# EAGLE design arcade_controller (EAGLE 6.3)

## Sheet 1 of 2: LM3S5749
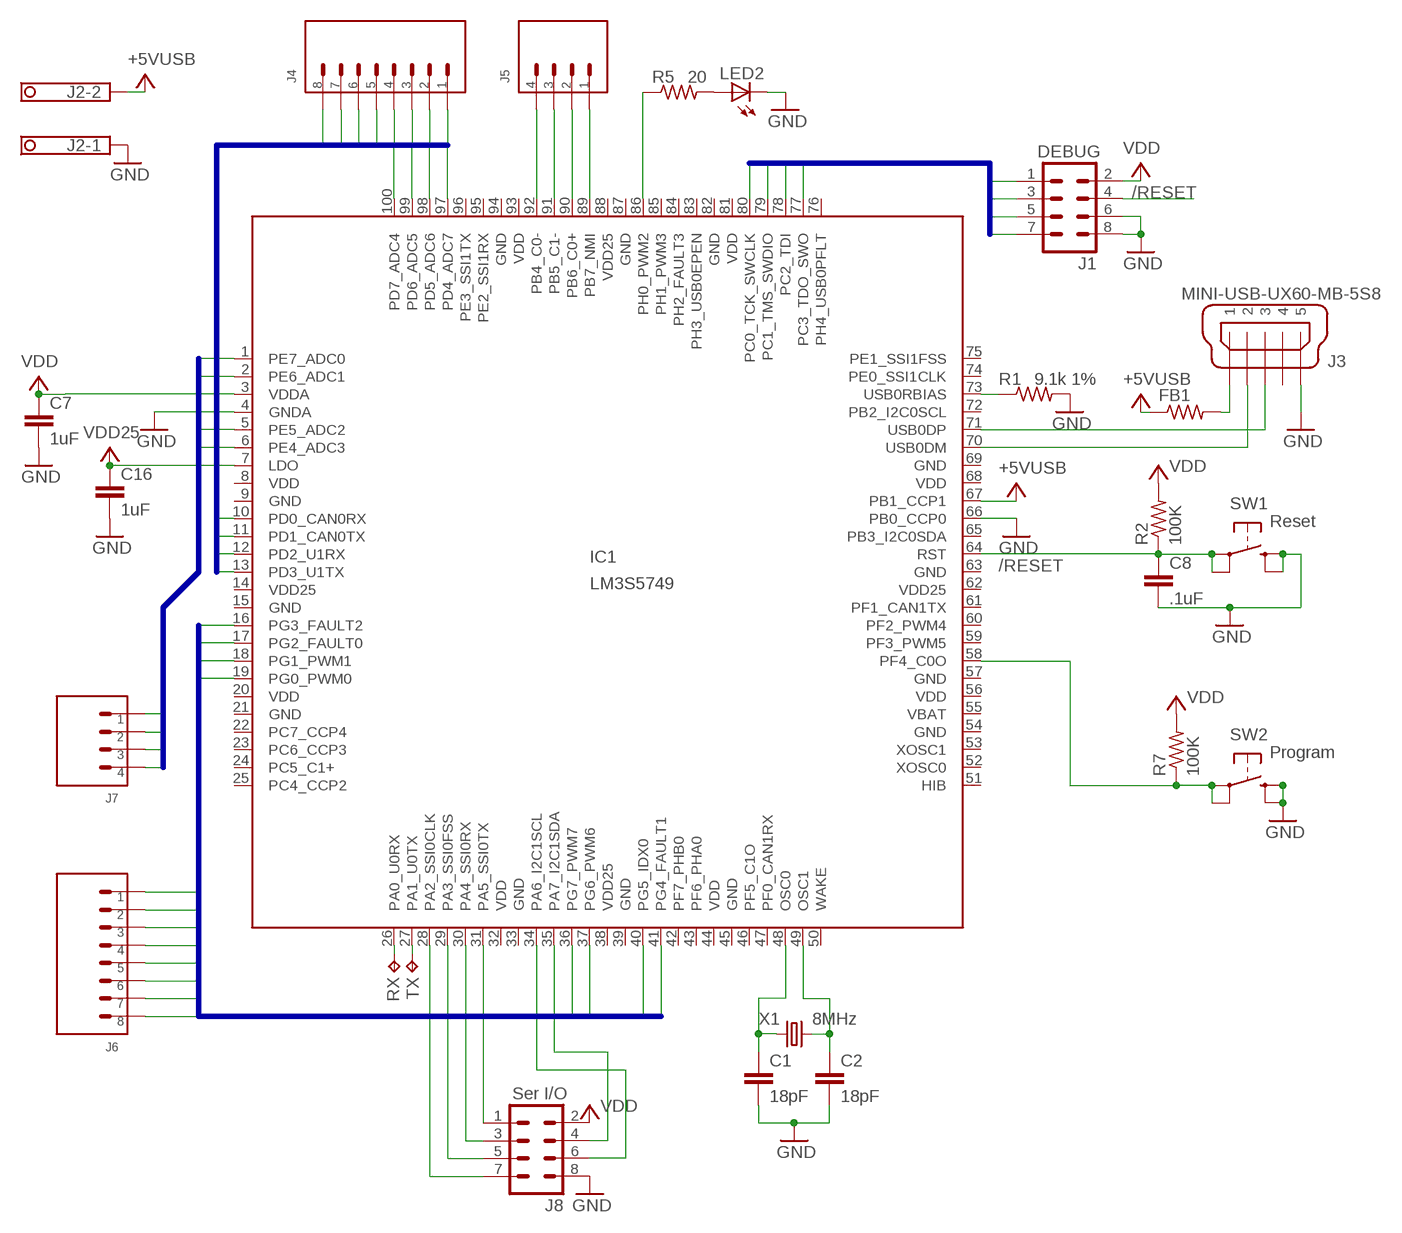
[diagram p0: schematic, sheet 1]

### Parts
C1  18pF  C-EUC0603  [C0603]
C2  18pF  C-EUC0603  [C0603]
C7  1uF  C-EUC0603  [C0603]
C8  .1uF  C-EUC0603  [C0603]
C16  1uF  C-EUC0603  [C0603]
FB1  0  R-US_R0805  [R0805]
IC1  LM3S5749  [LQFP-100]
J1  DEBUG  HEADER_4X2  [HEADER_.100IN_8PIN_4X2]
J2  1751248  [1751248]
J3  MINI-USB-UX60-MB-5S8  [UX60-MB-5S8]
J4  PTSM_1771088  [PTSM_1771088]
J5  PTSM_1702474  [PTSM_1702474]
J6  PTSM_1771088  [PTSM_1771088]
J7  PTSM_1702474  [PTSM_1702474]
J8  Ser I/O  HEADER_4X2  [HEADER_.100IN_8PIN_4X2]
LED2  LEDCHIPLED_0603  [CHIPLED_0603]
R1  9.1k 1%  R-US_R0603  [R0603]
R2  100K  R-US_R0603  [R0603]
R5  20  R-US_R0603  [R0603]
R7  100K  R-US_R0603  [R0603]
RX  TPTP10R  [TP10R]
SW1  Reset  SMT_PUSHBUTTON  [SMT_PUSHBUTTON]
SW2  Program  SMT_PUSHBUTTON  [SMT_PUSHBUTTON]
TX  TPTP10R  [TP10R]
X1  8MHz  XTAL_2SMD_8MMX4.5MM  [2-SMD_8MMX4.5MM]

### Nets
/PROG: IC1.58(PF4_C0O) R7.1 SW2.P$1(P1) SW2.P$2(P)
/RESET: C8.1 IC1.64(RST) J1.4 R2.1 SW1.P$1(P1) SW1.P$2(P)
GND [Filled Plane]: C1.2 C2.2 C7.2 C8.2 C16.2 IC1.4(GNDA) IC1.66(PB0_CCP0) J1.6 J1.8 J2.1 J3.5 J8.8 LED2.C R1.2 SW1.P$3(S1) SW1.P$4(S) SW2.P$3(S1) SW2.P$4(S) ; also sheet 2
N$1: IC1.73(USB0RBIAS) R1.1
N$2: C1.1 IC1.48(OSC0) X1.1
N$3: C2.1 IC1.49(OSC1) X1.2
N$5: IC1.26(PA0_U0RX) RX.TP
N$6: IC1.27(PA1_U0TX) TX.TP
N$7: FB1.2 J3.1
N$8: FB1.1 IC1.67(PB1_CCP1) J2.2 ; supply symbol labelled +5VUSB ; also sheet 2
N$9: IC1.89(PB7_NMI) J5.P$1(S1)
N$10: IC1.90(PB6_C0+) J5.P$2(S2)
N$11: IC1.91(PB5_C1-) J5.P$3(S3)
N$12: IC1.92(PB4_C0-) J5.P$4(S4)
N$13: IC1.86(PH0_PWM2) R5.1
N$14: IC1.31(PA5_SSI0TX) J8.1
N$15: LED2.A R5.2
N$16: IC1.30(PA4_SSI0RX) J8.3
N$17: IC1.71(USB0DP) J3.3
N$18: IC1.70(USB0DM) J3.2
N$19: IC1.29(PA3_SSI0FSS) J8.5
N$20: IC1.28(PA2_SSI0CLK) J8.7
N$21: IC1.35(PA7_I2C1SDA) J8.4
N$22: IC1.34(PA6_I2C1SCL) J8.6
PD0: IC1.10(PD0_CAN0RX) J4.P$1(S1)
PD1: IC1.11(PD1_CAN0TX) J4.P$2(S2)
PD2: IC1.12(PD2_U1RX) J4.P$3(S3)
PD3: IC1.13(PD3_U1TX) J4.P$4(S4)
PD4: IC1.97(PD4_ADC7) J4.P$5(S5)
PD5: IC1.98(PD5_ADC6) J4.P$6(S6)
PD6: IC1.99(PD6_ADC5) J4.P$7(S7)
PD7: IC1.100(PD7_ADC4) J4.P$8(S8)
PE4: IC1.6(PE4_ADC3) J7.P$4(S4)
PE5: IC1.5(PE5_ADC2) J7.P$3(S3)
PE6: IC1.2(PE6_ADC1) J7.P$2(S2)
PE7: IC1.1(PE7_ADC0) J7.P$1(S1)
PG0: IC1.19(PG0_PWM0) J6.P$8(S8)
PG1: IC1.18(PG1_PWM1) J6.P$7(S7)
PG2: IC1.17(PG2_FAULT0) J6.P$6(S6)
PG3: IC1.16(PG3_FAULT2) J6.P$5(S5)
PG4: IC1.41(PG4_FAULT1) J6.P$4(S4)
PG5: IC1.40(PG5_IDX0) J6.P$3(S3)
PG6: IC1.37(PG6_PWM6) J6.P$2(S2)
PG7: IC1.36(PG7_PWM7) J6.P$1(S1)
TCK: IC1.80(PC0_TCK_SWCLK) J1.1
TDI: IC1.78(PC2_TDI) J1.5
TDO: IC1.77(PC3_TDO_SWO) J1.7
TMS: IC1.79(PC1_TMS_SWDIO) J1.3
VDD: C7.1 IC1.3(VDDA) J1.2 J8.2 R2.2 R7.2 ; also sheet 2
VDD25: C16.1 IC1.7(LDO) ; also sheet 2
Unconnected: IC1.22(PC7_CCP4) IC1.23(PC6_CCP3) IC1.24(PC5_C1+) IC1.25(PC4_CCP2) IC1.42(PF7_PHB0) IC1.43(PF6_PHA0) IC1.46(PF5_C1O) IC1.47(PF0_CAN1RX) IC1.50(WAKE) IC1.51(HIB) IC1.52(XOSC0) IC1.53(XOSC1) IC1.55(VBAT) IC1.59(PF3_PWM5) IC1.60(PF2_PWM4) IC1.61(PF1_CAN1TX) IC1.65(PB3_I2C0SDA) IC1.72(PB2_I2C0SCL) IC1.74(PE0_SSI1CLK) IC1.75(PE1_SSI1FSS) IC1.76(PH4_USB0PFLT) IC1.83(PH3_USB0EPEN) IC1.84(PH2_FAULT3) IC1.85(PH1_PWM3) IC1.95(PE2_SSI1RX) IC1.96(PE3_SSI1TX) J3.4

### Buses
TCK,TMS,TDI,TDO
PG[0..7]
PD[0..7]
PE[4..7]

## Sheet 2 of 2: Power
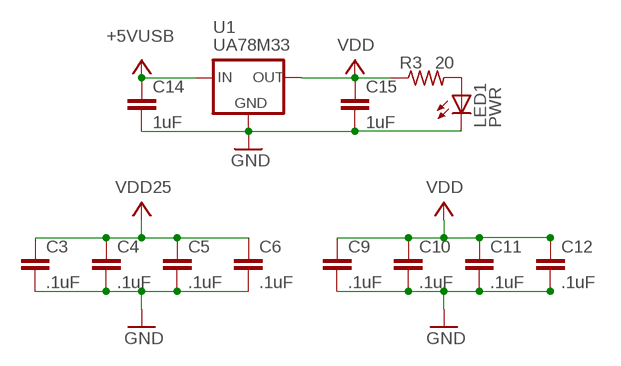
[diagram p1: schematic, sheet 2]

### Parts
C3  .1uF  C-EUC0603  [C0603]
C4  .1uF  C-EUC0603  [C0603]
C5  .1uF  C-EUC0603  [C0603]
C6  .1uF  C-EUC0603  [C0603]
C9  .1uF  C-EUC0603  [C0603]
C10  .1uF  C-EUC0603  [C0603]
C11  .1uF  C-EUC0603  [C0603]
C12  .1uF  C-EUC0603  [C0603]
C14  1uF  C-EUC0603  [C0603]
C15  1uF  C-EUC0603  [C0603]
LED1  PWR  LEDCHIPLED_0603  [CHIPLED_0603]
R3  20  R-US_R0603  [R0603]
U1  UA78M33  [SOT-223]

### Nets
GND [Filled Plane]: C3.2 C4.2 C5.2 C6.2 C9.2 C10.2 C11.2 C12.2 C14.2 C15.2 LED1.C U1.2(GND) U1.4(GND) ; also sheet 1
N$4: LED1.A R3.2
N$8: C14.1 U1.1(IN) ; supply symbol labelled +5VUSB ; also sheet 1
VDD: C9.1 C10.1 C11.1 C12.1 C15.1 R3.1 U1.3(OUT) ; also sheet 1
VDD25: C3.1 C4.1 C5.1 C6.1 ; also sheet 1

## Power pins joined to a net without a drawn wire
GND: IC1.9(GND) IC1.15(GND) IC1.21(GND) IC1.33(GND) IC1.39(GND) IC1.45(GND) IC1.54(GND) IC1.57(GND) IC1.63(GND) IC1.69(GND) IC1.82(GND) IC1.87(GND) IC1.94(GND)
VDD: IC1.8(VDD) IC1.20(VDD) IC1.32(VDD) IC1.44(VDD) IC1.56(VDD) IC1.68(VDD) IC1.81(VDD) IC1.93(VDD)
VDD25: IC1.14(VDD25) IC1.38(VDD25) IC1.62(VDD25) IC1.88(VDD25)

## Library data of the parts
C1-C12 C14-C16 = rcl:C-EU: CAPACITOR, European symbol
FB1 R1-R3 R5 R7 = rcl:R-US_: RESISTOR, American symbol
IC1 = Custom:LM3S5749: SPMM147_lm3s5749_ra0_lqfp_v1p0 edit this description Auto generated by make-symbol-device-package-bsdl_edited.ulp Rev. 42 Source: SPMM147_lm3s5749_ra0_lqfp_v1p0.bsdl
J1 J8 = Custom:HEADER_4X2
J2 = con-phoenix-350:1751248: MKDS 1/ 2-3,5 Printklemme Nennstrom: 10 A Bemessungsspannung: 160 V Raster: 3,5 mm Polzahl: 2 Montageart: Löten Anschlussart: Schraubanschluss Anschlussrichtung vom Leiter zur Platine: 0° Source: http://eshop.phoenixcontact.com .. 1751248.pdf; OC_FARNELL: unknown; OC_NEWARK: unknown
J3 = con-hirose:MINI-USB-: MINI USB Connector Source: http://www.hirose.co.jp/cataloge_hp/e24000019.pdf; OC_FARNELL: unknown; OC_NEWARK: unknown
J4 J6 = Custom:PTSM_1771088
J5 J7 = Custom:PTSM_1702474
LED1 LED2 = led:LED: LED OSRAM: - CHIPLED LG R971, LG N971, LY N971, LG Q971, LY Q971, LO R971, LY R971 LH N974, LH R974 LS Q976, LO Q976, LY Q976 LO Q996 - Hyper CHIPLED LW Q18S LB Q993, LB Q99A, LB R99A - SideLED LS A670, LO A670, LY A670, LG A670, LP A670 LB A673, LV A673, LT A673, LW A673 LH A674 LY A675 LS A676, LA A676, LO A676, LY A676, LW A676 LS A679, LY A679, LG A679 - Hyper Micro SIDELED® LS Y876, LA Y876, LO Y876, LY Y876 LT Y87S - SmartLED LW L88C, LW L88S LB L89C, LB L89S, LG L890 LS L89K, LO L89K, LY L89K LS L896, LA L896, LO L896, LY L896 - TOPLED LS T670, LO T670, LY T670, LG T670, LP T670 LSG T670, LSP T670, LSY T670, LOP T670, LYG T670 LG T671, LOG T671, LSG T671 LB T673, LV T673, LT T673, LW T673 LH T674 LS T676, LA T676, LO T676, LY T676, LB T676, LH T676, LSB T676, LW T676 LB T67C, LV T67C, LT T67C, LS T67K, LO T67K, LY T67K, LW E67C LS E67B, LA E67B, LO E67B, LY E67B, LB E67C, LV E67C, LT E67C LW T67C LS T679, LY T679, LG T679 LS T770, LO T770, LY T770, LG T770, LP T770 LB T773, LV T773, LT T773, LW T773 LH T774 LS E675, LA E675, LY E675, LS T675 LS T776, LA T776, LO T776, LY T776, LB T776 LHGB T686 LT T68C, LB T68C - Hyper Mini TOPLED® LB M676 - Mini TOPLED Santana® LG M470 LS M47K, LO M47K, LY M47K Source: http://www.osram.convergy.de LUXEON: - LUMILED® LXK2-PW12-R00, LXK2-PW12-S00, LXK2-PW14-U00, LXK2-PW14-V00 LXK2-PM12-R00, LXK2-PM12-S00, LXK2-PM14-U00 LXK2-PE12-Q00, LXK2-PE12-R00, LXK2-PE12-S00, LXK2-PE14-T00, LXK2-PE14-U00 LXK2-PB12-K00, LXK2-PB12-L00, LXK2-PB12-M00, LXK2-PB14-N00, LXK2-PB14-P00, LXK2-PB14-Q00 LXK2-PR12-L00, LXK2-PR12-M00, LXK2-PR14-Q00, LXK2-PR14-R00 LXK2-PD12-Q00, LXK2-PD12-R00, LXK2-PD12-S00 LXK2-PH12-R00, LXK2-PH12-S00 LXK2-PL12-P00, LXK2-PL12-Q00, LXK2-PL12-R00 Source: www.luxeon.com KINGBRIGHT: KA-3528ASYC Source: www.kingbright.com
RX TX = testpad:TP: Test pad
SW1 SW2 = Custom:SMT_PUSHBUTTON: SMT Pushbutton 5.2 x 5.2 mm
U1 = Custom:UA78M33: uA78M33 - Positive Voltage Regulator 3.3V 500mA Fixed Positive-Voltage Regulator Datasheet: http://www.ti.com/lit/ds/symlink/ua78m33.pdf; DIGIKEY: 296-13424-1-ND
X1 = Custom:XTAL_2SMD_8MMX4.5MM: SMD Crystal 2-SMD 8.0 x 4.5 x 1.4mm Crystal Taken from: http://www.abracon.com/Resonators/abm2.pdf; DIGIKEY: 535-10870-1-ND

## Board
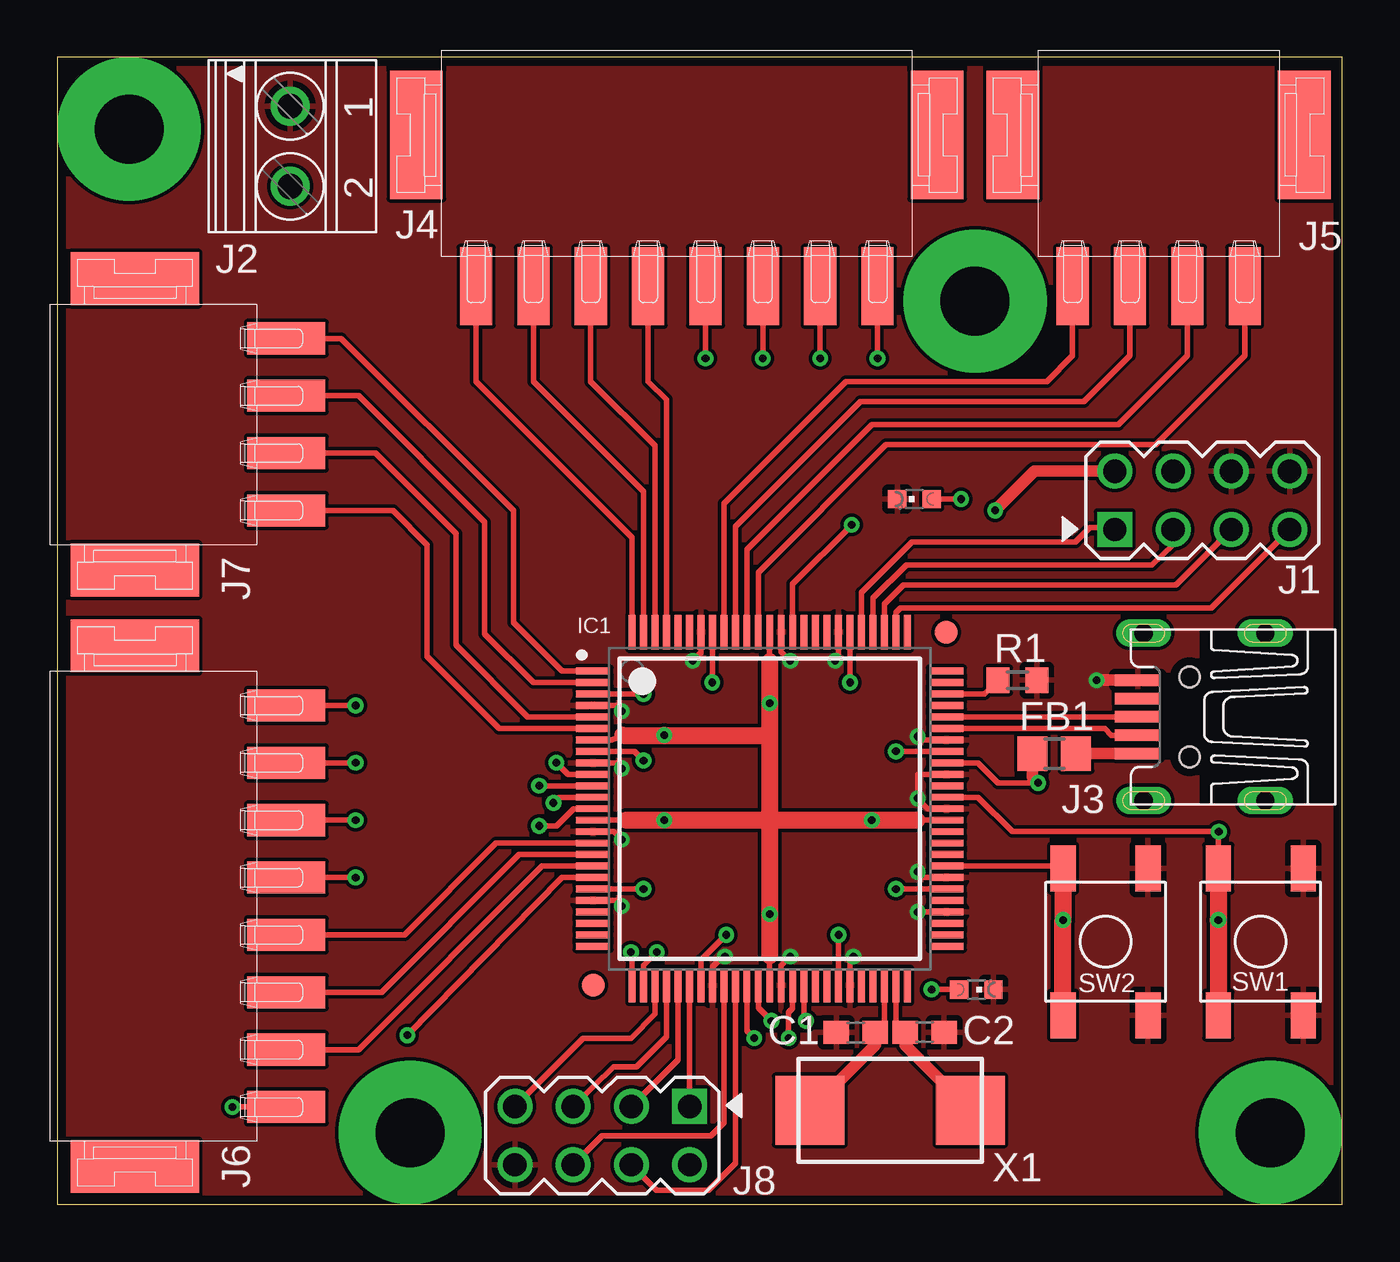
[diagram p2: board, top side]
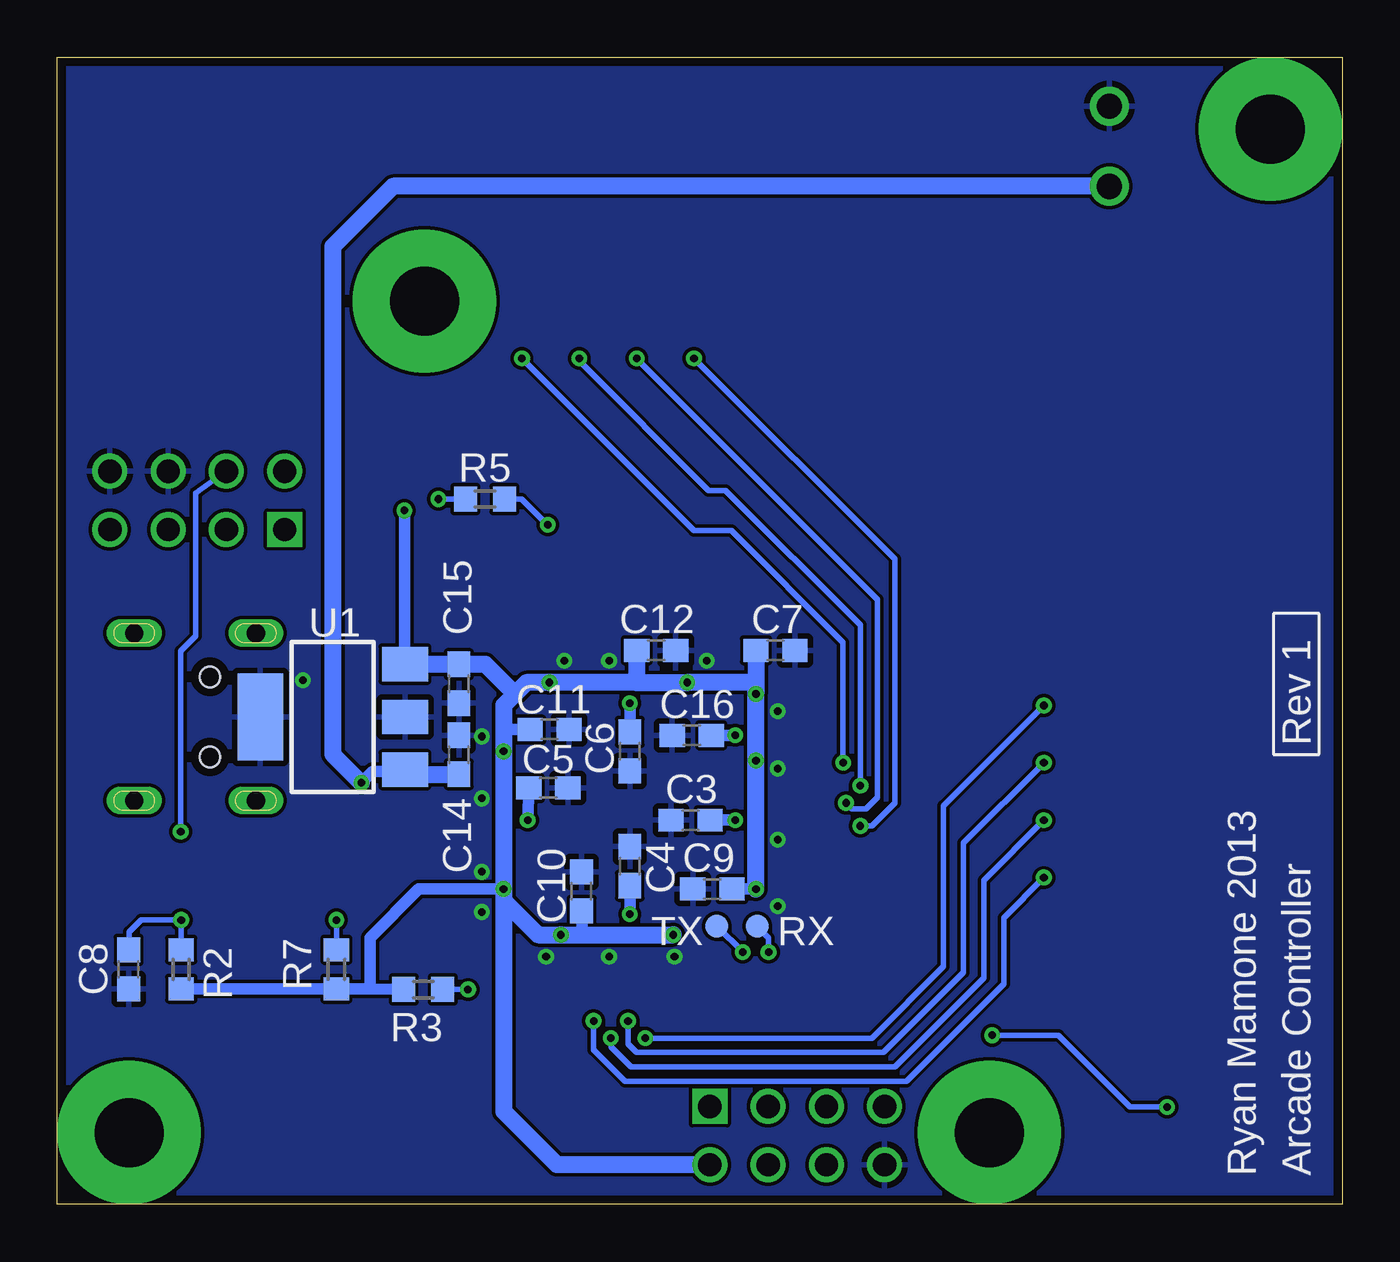
[diagram p3: board, bottom side, seen from below]

Size 56 x 50 mm. Coordinates in mm from the lower left corner, seen from the top.
Outline: 0,0 56,0 56,50 0,50 0,0
Copper layers (1*16): Top 0.0356mm / dielectric 1.5011mm / Bottom 0.0356mm
Design rules "LaenPCBOrder": minimum track width 6mil, minimum drill 13mil, track to track 6mil, track to pad 6mil, pad to pad 6mil, via to via 6mil, smd to smd 6mil, copper to edge 15mil, drill to drill 6mil, minimum pad ring 7mil, minimum via ring 7mil, stop-mask expansion 4mil, vias tented up to drill 0mil, thermal gap 10mil

### Footprints (pad centres in the part's own frame; a part is rotated, then mirrored left to right if it is on the bottom)
C0603 = smd 1.1 x 1: 1 -0.85,0; 2 0.85,0
R0805 = smd 1.3 x 1.5: 1 -0.95,0; 2 0.95,0
LQFP-100 = smd 1.5 x 0.3: 1 -7.7,6; 2 -7.7,5.5; 3 -7.7,5; 4 -7.7,4.5; 5 -7.7,4; 6 -7.7,3.5; 7 -7.7,3; 8 -7.7,2.5; 9 -7.7,2; 10 -7.7,1.5; 11 -7.7,1; 12 -7.7,0.5; 13 -7.7,0; 14 -7.7,-0.5; 15 -7.7,-1; 16 -7.7,-1.5; 17 -7.7,-2; 18 -7.7,-2.5; 19 -7.7,-3; 20 -7.7,-3.5; 21 -7.7,-4; 22 -7.7,-4.5; 23 -7.7,-5; 24 -7.7,-5.5; 25 -7.7,-6; 51 7.7,-6; 52 7.7,-5.5; 53 7.7,-5; 54 7.7,-4.5; 55 7.7,-4; 56 7.7,-3.5; 57 7.7,-3; 58 7.7,-2.5; 59 7.7,-2; 60 7.7,-1.5; 61 7.7,-1; 62 7.7,-0.5; 63 7.7,0; 64 7.7,0.5; 65 7.7,1; 66 7.7,1.5; 67 7.7,2; 68 7.7,2.5; 69 7.7,3; 70 7.7,3.5; 71 7.7,4; 72 7.7,4.5; 73 7.7,5; 74 7.7,5.5; 75 7.7,6 | smd 0.3 x 1.5: 26 -6,-7.7; 27 -5.5,-7.7; 28 -5,-7.7; 29 -4.5,-7.7; 30 -4,-7.7; 31 -3.5,-7.7; 32 -3,-7.7; 33 -2.5,-7.7; 34 -2,-7.7; 35 -1.5,-7.7; 36 -1,-7.7; 37 -0.5,-7.7; 38 0,-7.7; 39 0.5,-7.7; 40 1,-7.7; 41 1.5,-7.7; 42 2,-7.7; 43 2.5,-7.7; 44 3,-7.7; 45 3.5,-7.7; 46 4,-7.7; 47 4.5,-7.7; 48 5,-7.7; 49 5.5,-7.7; 50 6,-7.7; 76 6,7.7; 77 5.5,7.7; 78 5,7.7; 79 4.5,7.7; 80 4,7.7; 81 3.5,7.7; 82 3,7.7; 83 2.5,7.7; 84 2,7.7; 85 1.5,7.7; 86 1,7.7; 87 0.5,7.7; 88 0,7.7; 89 -0.5,7.7; 90 -1,7.7; 91 -1.5,7.7; 92 -2,7.7; 93 -2.5,7.7; 94 -3,7.7; 95 -3.5,7.7; 96 -4,7.7; 97 -4.5,7.7; 98 -5,7.7; 99 -5.5,7.7; 100 -6,7.7 | smd 1 x 1: 101 -7.7,-7.7; 102 7.7,7.7
HEADER_.100IN_8PIN_4X2 = drill 1.016 square: 1 -3.81,-1.27 | drill 1.016: 2 -3.81,1.27; 3 -1.27,-1.27; 4 -1.27,1.27; 5 1.27,-1.27; 6 1.27,1.27; 7 3.81,-1.27; 8 3.81,1.27
1751248 = drill 1.1 pad 1.7: 1 -1.75,-0.1; 2 1.75,-0.1
UX60-MB-5S8 = smd 2 x 0.5: 1 8.65,1.6; 2 8.65,0.8; 3 8.65,0; 4 8.65,-0.8; 5 8.65,-1.6 | drill 0.8 long: M1 3.1,-3.65; M2 3.1,3.65; M3 8.4,3.65; M4 8.4,-3.65 | hole 0.9: 6.4,-1.75; 6.4,1.75
PTSM_1771088 = smd 1.4 x 3.4: P$1 -8.75,6.6; P$2 -6.25,6.6; P$3 -3.75,6.6; P$4 -1.25,6.6; P$5 1.25,6.6; P$6 3.75,6.6; P$7 6.25,6.6; P$8 8.75,6.6 | smd 2.3 x 5.6: P$9 -11.35,0; P$10 11.35,0
PTSM_1702474 = smd 1.4 x 3.4: P$1 -3.75,6.6; P$2 -1.25,6.6; P$3 1.25,6.6; P$4 3.75,6.6 | smd 2.3 x 5.6: P$5 -6.35,0; P$6 6.35,0
CHIPLED_0603 = smd 0.8 x 0.8: A 0,-0.75; C 0,0.75
R0603 = smd 1 x 1.1: 1 -0.85,0; 2 0.85,0
TP10R = smd 1 x 1: TP 0,0
SMT_PUSHBUTTON = smd 2 x 1.1: P$1 -3.2,1.85; P$2 3.2,1.85; P$3 -3.2,-1.85; P$4 3.2,-1.85
SOT-223 = smd 1.5 x 2: 1 -2.3,-3.15; 2 0,-3.15; 3 2.3,-3.15 | smd 3.8 x 2: 4 0,3.15
2-SMD_8MMX4.5MM = smd 3 x 3: 1 -3.5,0; 2 3.5,0

### Placement (x,y rotation side)
C1  34.8,7.5 180 top
C2  37.8,7.5 0 top
C3  28.4,16.75 180 bottom
C4  31.05,14.75 90 bottom
C5  34.6,18.15 0 bottom
C6  31.05,19.75 270 bottom
C7  24.7,24.15 0 bottom
C8  52.9,10.25 270 bottom
C9  27.45,13.75 180 bottom
C10  33.15,13.65 90 bottom
C11  34.55,20.7 0 bottom
C12  29.9,24.15 0 bottom
C14  38.5,19.6 90 bottom
C15  38.5,22.7 270 bottom
C16  28.35,20.45 180 bottom
FB1  43.45,19.65 0 top
IC1  31.05,17.25 0 top
J1  49.9,30.69 0 top
J2  10.25,46.12 270 top
J3  55.75,21.25 180 top
J4  27,46.62 180 top
J5  48,46.62 180 top
J6  3.38,13 270 top
J7  3.38,34 270 top
J8  23.75,3 180 top
LED1  40.05,9.37 270 top
LED2  37.36,30.75 90 top
R1  41.85,22.85 0 top
R2  50.6,10.25 270 bottom
R3  40.05,9.37 0 bottom
R5  37.36,30.75 180 bottom
R7  43.84,10.25 270 bottom
RX  25.5,12.12 0 bottom
SW1  52.45,11.45 90 top
SW2  45.69,11.45 90 top
TX  27.25,12.12 0 bottom
U1  44,21.25 90 bottom
X1  36.3,4.1 0 top

### Tracks (layer width: path | path; a pad name or v marks a point on that pad's centre or on a via)
/PROG  (via drill 0.33 pad 0.51)
  Top 0.25: IC1.58 43.5,14.75 43.6,14.65 SW2.P$2 | 43.88,8.21 SW2.P$1
  Top 0.75: SW2.P$2 v43.84,12.4 SW2.P$1
  Bottom 0.25: R7.1 v43.84,12.4
/RESET  (via drill 0.33 pad 0.51)
  Top 0.25: IC1.64 40.12,17.75 41.62,16.25 v50.62,16.25 50.6,15.9 50.6,14.88 SW1.P$2
  Top 0.75: SW1.P$1 v50.6,12.4 SW1.P$2
  Bottom 0.25: C8.1 52.88,11.12 52.88,11.88 52.35,12.4 v50.6,12.4 R2.1 | J1.4 49.97,31 49.97,24.78 50.62,24.12 v50.62,16.25
GND  (via drill 0.33 pad 0.51)
  Top 0.25: v24.6,19 24.35,19.25 IC1.9 | v24.6,21.5 24.35,21.75 IC1.4 | v24.6,13 24.35,13.25 IC1.21 | v24.6,15.9 24.25,16.25 IC1.15 | v29.1,10.8 29,10.8 28.55,10.35 IC1.33 | v31.95,10.8 31.55,10.4 IC1.39 | v34.7,10.8 34.55,10.65 IC1.45 | v37.5,12.75 IC1.54 | v37.5,14.5 37.75,14.25 IC1.57 | v37.5,17.7 37.95,17.25 IC1.63 | v37.5,20.4 37.65,20.25 IC1.69 | v33.9,23.7 34.05,23.85 IC1.82 | v31.95,23.7 31.55,24.1 IC1.87 | v27.7,23.7 28.05,24.05 IC1.94 | 37.5,17.75 37.5,18.75 IC1.66
  Top 0.5: J3.5 v45.3,22.85
  pour Bottom: 0,50 56,50 56,0 0,0
  pour Top: 0,50 56,50 56,0 0,0
N$1
  Top 0.25: IC1.73 40.4,22.25 R1.1
N$2
  Top 0.25: C1.1 36.05,7.9 IC1.48
  Top 0.5: C1.1 35.65,6.95 X1.1
N$3
  Top 0.25: C2.1 36.55,7.9 IC1.49
  Top 0.5: C2.1 36.95,6.95 X1.2
N$4  (via drill 0.33 pad 0.51)
  Top 0.25: LED1.A v38.1,9.37
  Bottom 0.25: R3.2 v38.1,9.37
N$5  (via drill 0.33)
  Top 0.25: IC1.26 25.05,10.93 v25,11
  Bottom 0.25: v25,11 25,11.62 RX.TP
N$6  (via drill 0.33 pad 0.51)
  Top 0.25: IC1.27 25.55,10.43 v26.12,11
  Bottom 0.25: v26.12,11 TX.TP
N$7
  Top 0.5: J3.1 FB1.2
N$8  (via drill 0.33 pad 0.51)
  Top 0.25: IC1.67 40.12,19.25 41,18.38 v42.75,18.38
  Top 0.5: FB1.1 42.5,18.62 v42.75,18.38
  Bottom 0.5: v42.75,18.38 42.25,18.88 41.5,18.88 41.17,19 U1.1
  Bottom 0.75: U1.1 40.65,18.75 C14.1 | J2.2 41.38,44.38 44,41.75 44,19.62 v42.75,18.38
N$9
  Top 0.25: J5.P$1 51.75,37 47.88,33.12 36.12,33.12 30.55,27.55 IC1.89
N$10
  Top 0.25: IC1.90 30.05,28.55 35.5,34 46.25,34 49.25,37 J5.P$2
N$11
  Top 0.25: IC1.91 29.55,29.55 35,35 44.75,35 46.75,37 J5.P$3
N$12
  Top 0.25: IC1.92 29.05,30.55 34.38,35.88 43.12,35.88 44.25,37 J5.P$4
N$13  (via drill 0.33 pad 0.61)
  Top 0.25: IC1.86 32.05,27.05 v34.62,29.62
  Bottom 0.25: v34.62,29.62 35.76,30.75 R5.1
N$14
  Top 0.25: IC1.31 J8.1
N$15  (via drill 0.33 pad 0.51)
  Top 0.25: LED2.A v39.39,30.75
  Bottom 0.25: v39.39,30.75 R5.2
N$16
  Top 0.25: IC1.30 27.05,6.3 J8.3
N$17
  Top 0.25: IC1.71 J3.3
N$18
  Top 0.25: J3.2 45.95,20.45 45.65,20.75 IC1.70
N$19
  Top 0.25: IC1.29 26.55,7.3 25.25,6 24.25,6 J8.5
N$20
  Top 0.25: IC1.28 26.05,8.3 25,7.25 22.92,7.25 J8.7
N$21
  Top 0.25: IC1.35 29.55,1.8 28.38,0.62 26.12,0.62 J8.4
N$22
  Top 0.25: IC1.34 29.05,3.55 28.5,3 23.75,3 J8.6
N$23  (via drill 3 pad 6.25)
  other vias: 52.88,3.12
N$24  (via drill 3 pad 6.25)
  other vias: 15.38,3.12
N$25  (via drill 3 pad 6.25)
  other vias: 3.12,46.88
N$26  (via drill 3 pad 6.25)
  other vias: 40,39.38
PD0  (via drill 0.33 pad 0.51)
  Top 0.25: J4.P$1 v35.75,36.88 | v21.75,19.25 22.25,18.75 IC1.10
  Bottom 0.25: v35.75,36.88 28.25,29.38 26.62,29.38 21.75,24.5 v21.75,19.25
PD1  (via drill 0.33 pad 0.51, 0.33 pad 0.61)
  Top 0.25: J4.P$2 v33.25,36.88 | v21,18.25 IC1.11
  Bottom 0.25: v33.25,36.88 33.25,36.75 27.62,31.12 26.88,31.12 21,25.25 v21,18.25
PD2  (via drill 0.33 pad 0.61)
  Top 0.25: J4.P$3 v30.75,36.88 | v21.62,17.5 21.88,17.75 IC1.12
  Bottom 0.25: v30.75,36.88 20.25,26.38 20.25,17.75 20.75,17.25 21.38,17.25 v21.62,17.5
PD3  (via drill 0.33 pad 0.61)
  Top 0.25: J4.P$4 v28.25,36.88 | v21,16.5 21.75,16.5 22.5,17.25 IC1.13
  Bottom 0.25: v28.25,36.88 19.5,28.12 19.5,17.5 20.5,16.5 v21,16.5
PD4
  Top 0.25: IC1.97 26.55,35.08 25.75,35.88 J4.P$5
PD5
  Top 0.25: IC1.98 26.05,33.08 23.25,35.88 J4.P$6
PD6
  Top 0.25: IC1.99 25.55,31.07 20.75,35.88 J4.P$7
PD7
  Top 0.25: IC1.100 25.05,29.07 18.25,35.88 J4.P$8
PE4
  Top 0.25: IC1.6 19.25,20.75 16.12,23.88 16.12,28.75 14.62,30.25 J7.P$4
PE5
  Top 0.25: IC1.5 20.5,21.25 17.38,24.38 17.38,29.25 13.88,32.75 J7.P$3
PE6
  Top 0.25: IC1.2 20.75,22.75 18.62,24.88 18.62,29.75 13.12,35.25 J7.P$2
PE7
  Top 0.25: IC1.1 22,23.25 19.88,25.38 19.88,30.25 12.38,37.75 J7.P$1
PG0  (via drill 0.33 pad 0.51)
  Top 0.25: IC1.19 22,14.25 v15.25,7.38 | v7.62,4.25 J6.P$8
  Bottom 0.25: v15.25,7.38 12.38,7.38 9.25,4.25 v7.62,4.25
PG1
  Top 0.25: IC1.18 21.12,14.75 13.12,6.75 J6.P$7
PG2
  Top 0.25: IC1.17 20.12,15.25 14.12,9.25 J6.P$6
PG3
  Top 0.25: IC1.16 19.12,15.75 15.12,11.75 J6.P$5
PG4  (via drill 0.33 pad 0.51)
  Top 0.25: IC1.41 32.55,8.2 v32.62,8 | v13,14.25 J6.P$4
  Bottom 0.25: v32.62,8 32.62,6.75 31.25,5.38 19,5.38 14.75,9.62 14.75,12.5 v13,14.25
PG5  (via drill 0.33 pad 0.51)
  Top 0.25: IC1.40 32.05,8.55 31.88,8.38 v31.88,7.25 | v13,16.75 J6.P$3
  Bottom 0.25: v31.88,7.25 31.88,6.88 31,6 19.5,6 15.62,9.88 15.62,14.12 v13,16.75
PG6  (via drill 0.33 pad 0.51)
  Top 0.25: IC1.37 30.55,8.57 v31.12,8 | v13,19.25 J6.P$2
  Bottom 0.25: v31.12,8 31.12,7 30.75,6.62 20,6.62 16.5,10.12 16.5,15.75 v13,19.25
PG7  (via drill 0.33 pad 0.51)
  Top 0.25: IC1.36 30.05,7.58 v30.38,7.25 | v13,21.75 J6.P$1
  Bottom 0.25: v30.38,7.25 20.5,7.25 17.38,10.38 17.38,17.38 v13,21.75
TCK
  Top 0.25: IC1.80 35.05,26.68 37.25,28.88 44.38,28.88 45,29.5 45.62,29.5 45.92,29.42 J1.1
TDI
  Top 0.25: IC1.78 36.05,26.18 36.88,27 48.75,27 J1.5
TDO
  Top 0.25: IC1.77 36.55,25.8 36.75,26 50.29,26 J1.7
TMS
  Top 0.25: IC1.79 35.55,26.43 37,27.88 47.71,27.88 48.62,28.75 J1.3
VDD  (via drill 0.33 pad 0.51, 0.33 pad 0.61)
  Top 0.25: IC1.8 25.15,19.75 v25.55,19.35 | IC1.3 v25.55,22.25 | v25.55,13.75 IC1.20 | IC1.93 v28.55,22.75 | IC1.81 v34.55,22.75 | IC1.68 v36.55,19.75 | IC1.56 v36.55,13.75 | IC1.44 v34.05,11.75 | IC1.32 28.05,10.65 v29.15,11.75
  Top 0.5: v40.88,30.25 42.58,31.96 J1.2
  Bottom 0.5: v25.55,13.75 C9.1 | C10.1 33.1,11.75 | C11.1 36.55,20.7 v36.55,19.75 | R3.1 | R2.2 R7.2 42.38,9.4 | v36.55,13.75 40.25,13.75 42.38,11.62 42.38,9.4 | 42.38,9.4 42.23,9.4 40.88,9.38 R3.1 | U1.3 40.88,23.57 v40.88,30.25
  Bottom 0.75: v25.55,13.75 v25.55,19.35 v25.55,22.25 | v25.55,22.25 25.55,22.75 v28.55,22.75 30.75,22.75 | 30.75,22.75 v34.55,22.75 35.55,22.75 36.05,22.25 | 36.05,22.25 36.55,21.75 v36.55,19.75 v36.55,13.75 | v36.55,13.75 36.55,13.25 35.05,11.75 v34.05,11.75 33.1,11.75 v29.15,11.75 | C7.1 v25.55,22.25 | C12.1 30.75,22.75 | U1.3 C15.1 37.35,23.55 36.05,22.25 | R3.1 | J8.2 34.23,1.73 36.55,4.05 v36.55,13.75
VDD25  (via drill 0.33 pad 0.51)
  Top 0.25: IC1.7 24.15,20.25 24.65,20.45 | IC1.14 24.8,16.75 | IC1.38 31.05,10.85 | IC1.62 37.45,16.75 | IC1.88 31.05,23.65
  Top 0.75: 24.8,16.75 v26.45,16.75 31.05,16.75 | 31.05,16.75 v31.05,12.65 31.05,10.85 | 31.05,23.65 v31.05,21.85 31.05,20.45 | 24.65,20.45 v26.45,20.45 31.05,20.45 | 31.05,20.45 31.05,16.75 | 31.05,16.75 v35.5,16.75 37.45,16.75
  Bottom 0.5: v26.45,20.45 C16.1 | v26.45,16.75 C3.1 | v31.05,12.65 C4.1 | v35.5,16.75 C5.1 | v31.05,21.85 C6.1

### Text on the board
bNames: Rev 1 | Arcade Controller | Ryan Mamone 2013